# EAGLE design Radio EV1 (EAGLE 7.4.0)
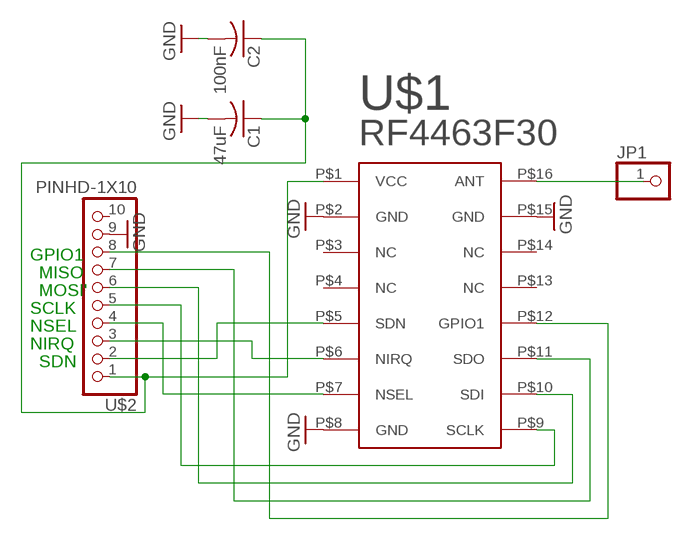
[diagram p0: schematic, sheet 1]

## Parts
C1  47uF  C-USC0805  [C0805]
C2  100nF  C-USC0805  [C0805]
JP1  PINHD-1X1CB  [1X01-CLEANBIG]
U$1  RF4463F30  [RF4463F30]
U$2  PINHD-1X10  [1X10-BIG]

## Nets
GND: C1.2 C2.2 U$1.P$2(GND) U$1.P$8(GND) U$1.P$15(GND) U$2.9
GPIO1: U$1.P$12(GPIO1) U$2.8
N$8: JP1.1 U$1.P$16(ANT)
NIRQ: U$1.P$6(NIRQ) U$2.3
NSEL: U$1.P$7(NSEL) U$2.4
SCLK: U$1.P$9(SCLK) U$2.5
SDI: U$1.P$10(SDI) U$2.6
SDN: U$1.P$5(SDN) U$2.2
SDO: U$1.P$11(SDO) U$2.7
VCC: C1.1 C2.1 U$1.P$1(VCC) U$2.1
Unconnected: U$1.P$3(NC) U$1.P$4(NC) U$1.P$13(NC) U$1.P$14(NC) U$2.10

## Notes on the sheet
- GPIO1
- MISO
- MOSI'
- SCLK
- NSEL
- NIRQ
- SDN

## Library data of the parts
C1 C2 = adafruit:C-US: CAPACITOR, American symbol
JP1 = adafruit:PINHD-1X1: Pin header 1x1 for 0.1" spacing With round pins
U$1 = radio:RF4463F30: Radio
U$2 = adafruit:PINHD-1X10: Pin header 1x10 0.1" spacing With round pins

## Board
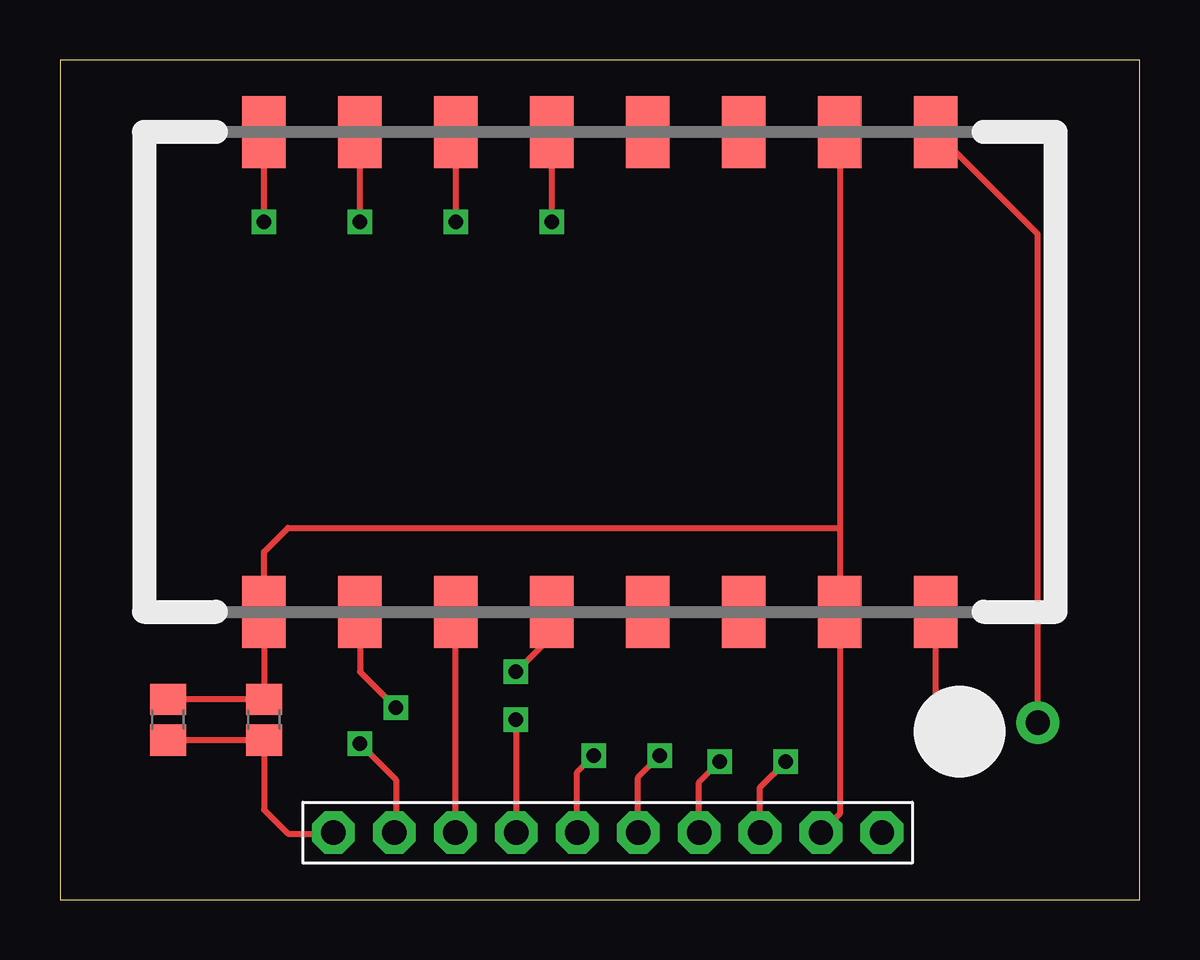
[diagram p1: board, top side]
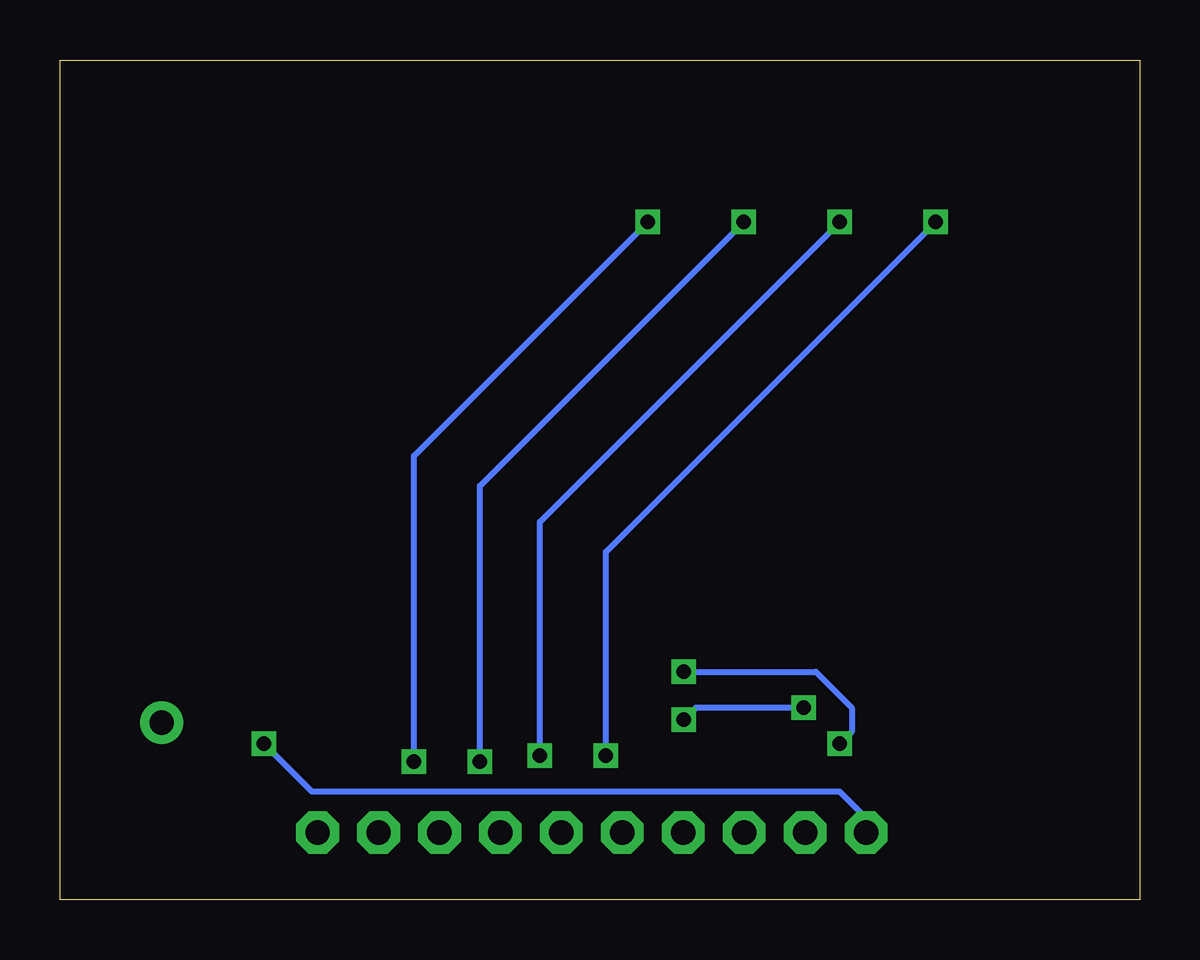
[diagram p2: board, bottom side, seen from below]

Size 45 x 35 mm. Coordinates in mm from the lower left corner, seen from the top.
Outline: 0,0 45,0 45,35 0,35 0,0
Copper layers (1*16): Top 0.035mm / dielectric 1.5mm / Bottom 0.035mm
Design rules "default": minimum track width 10mil, minimum drill 24mil, track to track 8mil, track to pad 8mil, pad to pad 8mil, via to via 8mil, smd to smd 8mil, copper to edge 40mil, drill to drill 8mil, minimum pad ring 10mil, minimum via ring 8mil, stop-mask expansion 4mil, vias tented up to drill 0mil, thermal gap 10mil

### Footprints (pad centres in the part's own frame; a part is rotated, then mirrored left to right if it is on the bottom)
C0805 = smd 1.3 x 1.5: 1 -0.85,0; 2 0.85,0
1X01-CLEANBIG = drill 1.016 pad 1.778: 1 0,0
RF4463F30 = smd 1.8 x 3: P$1 33,-20; P$2 29,-20; P$3 25,-20; P$4 21,-20; P$5 17,-20; P$6 13,-20; P$7 9,-20; P$8 5,-20; P$9 5,0; P$10 9,0; P$11 13,0; P$12 17,0; P$13 21,0; P$14 25,0; P$15 29,0; P$16 33,0
1X10-BIG = drill 1.016 pad 1.778 octagon: 1 -11.43,0; 2 -8.89,0; 3 -6.35,0; 4 -3.81,0; 5 -1.27,0; 6 1.27,0; 7 3.81,0; 8 6.35,0; 9 8.89,0; 10 11.43,0

### Placement (x,y rotation side)
C1  4.5,7.5 90 top
C2  8.5,7.5 90 top
JP1  40.76,7.37 0 top
U$1  3.5,32 0 top
U$2  22.83,2.79 0 top

### Tracks (layer width: path | path; a pad name or v marks a point on that pad's centre or on a via)
GND
  Top 0.254: U$1.P$15 32.5,15.5 | 32.5,15.5 U$1.P$2 32.5,3.57 U$2.9 | C1.2 C2.2 U$1.P$8 8.5,14.5 9.5,15.5 32.5,15.5
GPIO1  (via drill 0.6)
  Top 0.254: U$2.8 29.18,4.68 v30.25,5.75 | v20.5,28.25 U$1.P$12
  Bottom 0.254: v30.25,5.75 30.25,18.5 v20.5,28.25
N$8
  Top 0.254: JP1.1 40.76,27.74 U$1.P$16
NIRQ
  Top 0.254: U$2.3 16.48,11.98 U$1.P$6
NSEL  (via drill 0.6)
  Top 0.254: U$1.P$7 12.5,9.5 v14,8 | v19,7.5 19,2.81 U$2.4
  Bottom 0.254: v14,8 18.5,8 v19,7.5
SCLK  (via drill 0.6)
  Top 0.254: U$2.5 21.56,5.31 v22.25,6 | v8.5,28.25 U$1.P$9
  Bottom 0.254: v22.25,6 22.25,14.5 v8.5,28.25
SDI  (via drill 0.6)
  Top 0.254: U$2.6 24.1,5.1 v25,6 | v12.5,28.25 U$1.P$10
  Bottom 0.254: v25,6 25,15.75 v12.5,28.25
SDN  (via drill 0.6)
  Top 0.254: U$1.P$5 20.5,11 v19,9.5 | v12.5,6.5 14,5 14,2.85 U$2.2
  Bottom 0.254: v19,9.5 13.5,9.5 12,8 12,7 v12.5,6.5
SDO  (via drill 0.6)
  Top 0.254: U$2.7 26.64,4.89 v27.5,5.75 | v16.5,28.25 U$1.P$11
  Bottom 0.254: v27.5,5.75 27.5,17.25 v16.5,28.25
VCC  (via drill 0.6)
  Top 0.254: C1.1 C2.1 8.5,3.75 9.5,2.75 11.36,2.75 U$2.1 | v36.5,6.5 U$1.P$1
  Bottom 0.254: U$2.1 11.4,3.4 12.5,4.5 34.5,4.5 v36.5,6.5